# EAGLE design INTERFACE (EAGLE 6.2)
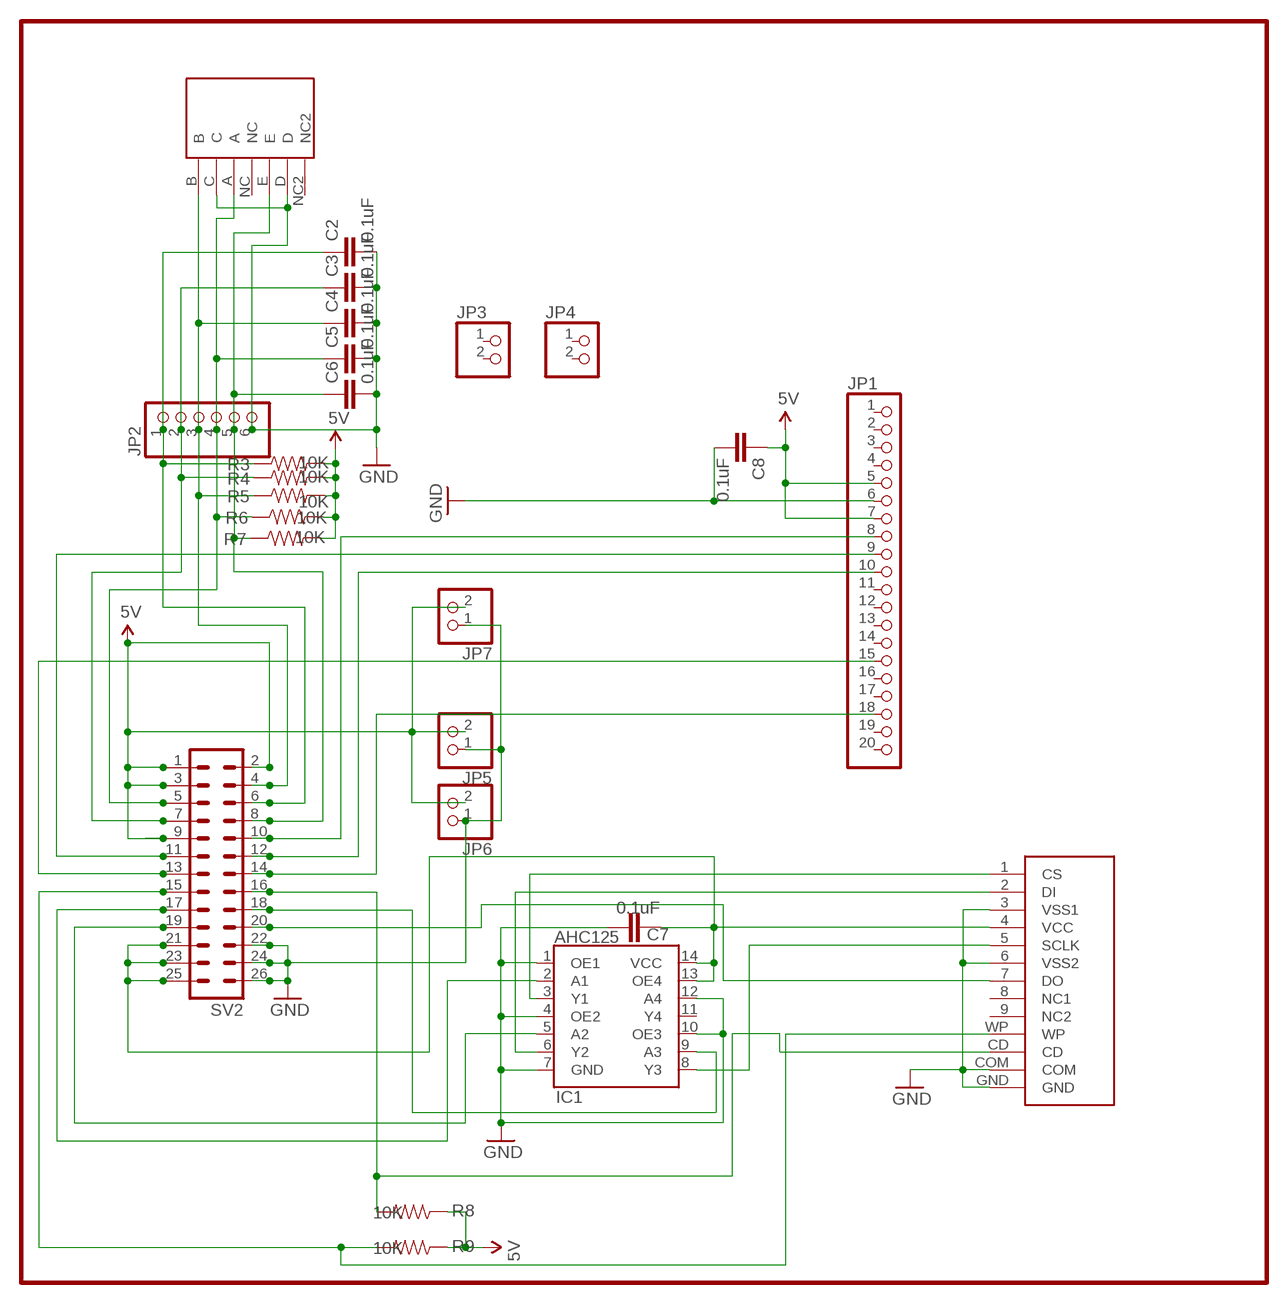
[diagram p0: schematic, sheet 1]

## Parts
C2  0.1uF  CAP0805  [0805]
C3  0.1uF  CAP0805  [0805]
C4  0.1uF  CAP0805  [0805]
C5  0.1uF  CAP0805  [0805]
C6  0.1uF  CAP0805  [0805]
C7  0.1uF  CAP0805  [0805]
C8  0.1uF  CAP0805  [0805]
IC1  AHC125  [DIN14]
JP1  PINHD-1X20  [1X20]
JP2  PINHD-1X6  [1X06]
JP3  PINHD-1X2  [1X02]
JP4  PINHD-1X2  [1X02]
JP5  PINHD-1X2  [1X02]
JP6  PINHD-1X2  [1X02]
JP7  PINHD-1X2  [1X02]
Q2  SDCARD  [SDCARD]
R3  10K  RESISTOR  [0805]
R4  10K  RESISTOR  [0805]
R5  10K  RESISTOR  [0805]
R6  10K  RESISTOR  [0805]
R7  10K  RESISTOR  [0805]
R8  10K  RESISTOR  [0805]
R9  10K  RESISTOR  [0805]
S2  DJFS  [PIN5]
SV2  ML26L  [ML26L]

## Nets
5V: C8.1 JP1.5 JP1.7 JP5.2 JP6.2 JP7.2 R3.2 R4.2 R5.2 R6.2 R7.2 R8.1 R9.1 SV2.1 SV2.2 SV2.3 SV2.9
GND2: C2.2 C3.2 C4.2 C5.2 C6.2 C7.2 C8.2 IC1.1(OE1) IC1.4(OE2) IC1.7(GND) IC1.10(OE3) IC1.12(A4) JP1.6 JP2.6 JP5.1 JP6.1 JP7.1 Q2.3(VSS1) Q2.6(VSS2) Q2.COM Q2.GND S2.C S2.D SV2.22 SV2.24 SV2.26 ; supply symbol labelled GND
N$2: IC1.3(Y1) Q2.1(CS)
N$5: C2.1 JP2.1 R3.1 SV2.6
N$8: IC1.2(A1) SV2.17
N$10: IC1.6(Y2) Q2.2(DI)
N$12: Q2.CD R8.2 SV2.16
N$13: Q2.7(DO) SV2.20
N$18: JP1.15 SV2.13
N$19: JP1.8 SV2.10
N$20: JP1.10 SV2.12
N$21: JP1.9 SV2.11
N$22: JP1.18 SV2.14
N$23: IC1.8(Y3) Q2.5(SCLK)
N$27: C3.1 JP2.2 R4.1 SV2.7
N$28: C4.1 JP2.3 R5.1 S2.B SV2.4
N$29: C5.1 JP2.4 R6.1 S2.A SV2.5
N$30: C6.1 JP2.5 R7.1 S2.E SV2.8
N$31: Q2.WP R9.2 SV2.15
N$33: IC1.5(A2) SV2.19
N$34: C7.1 IC1.13(OE4) IC1.14(VCC) Q2.4(VCC) SV2.21 SV2.23 SV2.25
N$35: IC1.9(A3) SV2.18
Unconnected: IC1.11(Y4) JP1.1 JP1.2 JP1.3 JP1.4 JP1.11 JP1.12 JP1.13 JP1.14 JP1.16 JP1.17 JP1.19 JP1.20 JP3.1 JP3.2 JP4.1 JP4.2 Q2.8(NC1) Q2.9(NC2) S2.NC S2.NC2

## Library data of the parts
C2-C8 = SparkFun2:CAP: Capacitor Standard 0603 ceramic capacitor, and 0.1" leaded capacitor.
IC1 = ahc:AHC125
JP1 = pinhead:PINHD-1X20: PIN HEADER
JP2 = pinhead:PINHD-1X6: PIN HEADER
JP3-JP7 = pinhead:PINHD-1X2: PIN HEADER
Q2 = sd:SDCARD
R3-R9 = SparkFun:RESISTOR: Resistor Basic schematic elements and footprints for 0603, 1206, and PTH 1/10th watt (small) resistors.
S2 = yjfs:DJFS
SV2 = con-ml:ML26L: HARTING; OC_FARNELL: unknown; OC_NEWARK: unknown

## Net classes
0 default: width 0.203 mm, drill 0.508 mm, clearance 0.203 mm
1 5V: width 0.381 mm, drill 0.508 mm, clearance 0.254 mm
2 gnd: width 0.381 mm, drill 0.508 mm, clearance 0.254 mm
3 3.3V: width 0.381 mm, drill 0.508 mm, clearance 0.254 mm

## Board
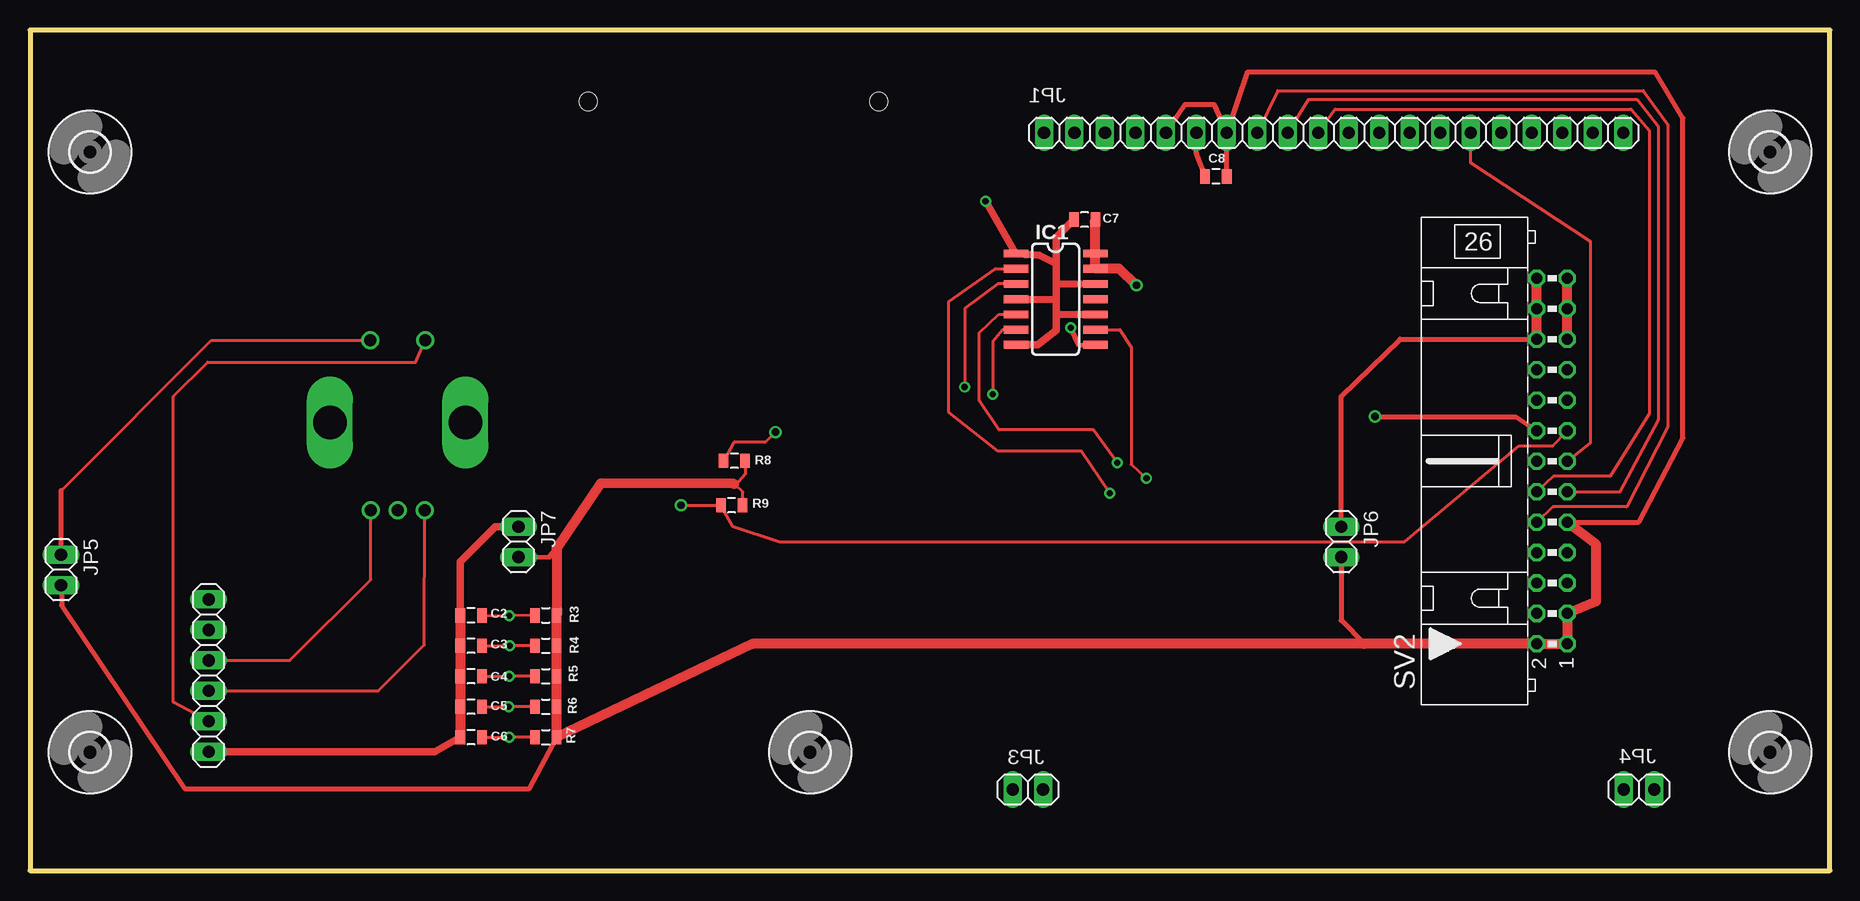
[diagram p1: board, top side]
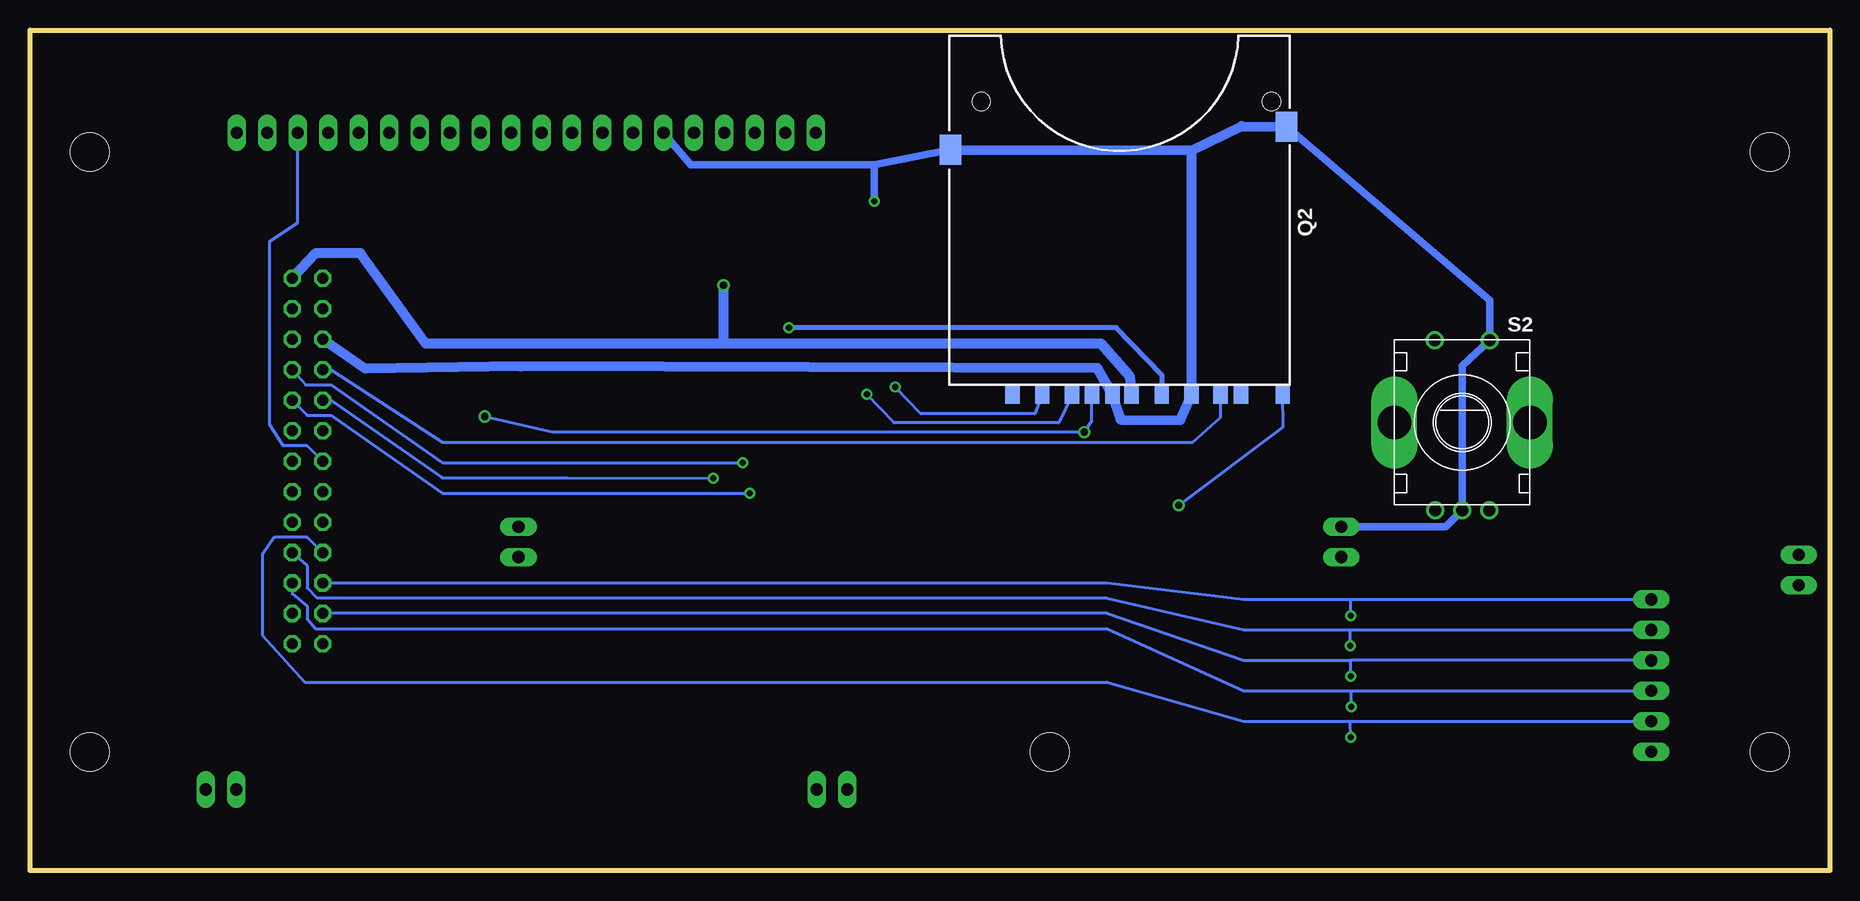
[diagram p2: board, bottom side, seen from below]

Size 149.99 x 70.06 mm. Coordinates in mm from the lower left corner, seen from the top.
Outline: 0,70.06 0,0 149.99,0 149.99,70.06 0,70.06
Copper layers (1*16): Top 0.035mm / dielectric 1.5mm / Bottom 0.035mm
Design rules: minimum track width 10mil, minimum drill 24mil, track to track 8mil, track to pad 8mil, pad to pad 8mil, via to via 8mil, smd to smd 8mil, copper to edge 40mil, drill to drill 8mil, minimum pad ring 10mil, minimum via ring 8mil, stop-mask expansion 4mil, vias tented up to drill 0mil, thermal gap 10mil

### Footprints (pad centres in the part's own frame; a part is rotated, then mirrored left to right if it is on the bottom)
0805 = smd 0.8 x 1.2: 1 -0.9,0; 2 0.9,0
DIN14 = smd 0.66 x 2.032: 1 -3.175,-3.315; 2 -1.905,-3.315; 3 -0.635,-3.315; 4 0.635,-3.315; 5 1.905,-3.315; 6 3.175,-3.315; 7 4.445,-3.315; 8 4.445,3.315; 9 3.175,3.315; 10 1.905,3.315; 11 0.635,3.315; 12 -0.635,3.315; 13 -1.905,3.315; 14 -3.175,3.315
1X20 = drill 1.016 long: 1 -24.13,0; 2 -21.59,0; 3 -19.05,0; 4 -16.51,0; 5 -13.97,0; 6 -11.43,0; 7 -8.89,0; 8 -6.35,0; 9 -3.81,0; 10 -1.27,0; 11 1.27,0; 12 3.81,0; 13 6.35,0; 14 8.89,0; 15 11.43,0; 16 13.97,0; 17 16.51,0; 18 19.05,0; 19 21.59,0; 20 24.13,0
1X06 = drill 1.016 long: 1 -6.35,0; 2 -3.81,0; 3 -1.27,0; 4 1.27,0; 5 3.81,0; 6 6.35,0
1X02 = drill 1.016 long: 1 -1.27,0; 2 1.27,0
SDCARD = smd 1.2 x 1.5: 1 5.74,13.411; 2 3.251,13.411; 3 -0.102,13.411; 4 -1.702,13.411; 5 -4.216,13.411; 6 -6.706,13.411; 7 -9.119,13.411; 8 -10.82,13.411; 9 8.23,13.411; CD 1.6,13.411; WP -14.3,13.411 | smd 1.779 x 2.5: COM -14.624,-8.91; GND 13.386,-6.985 | hole 1.5: -13.37,-11.01; 10.83,-11.01
PIN5 = drill 1: A 3.409,-0.45; B 7.891,-0.45; C 5.65,-0.45; D 7.942,13.716; E 3.358,13.716 | drill 2.8 long: NC 0,6.875; NC2 11.3,6.875
ML26L = drill 0.914 octagon: 1 -15.24,-1.27; 2 -15.24,1.27; 3 -12.7,-1.27; 4 -12.7,1.27; 5 -10.16,-1.27; 6 -10.16,1.27; 7 -7.62,-1.27; 8 -7.62,1.27; 9 -5.08,-1.27; 10 -5.08,1.27; 11 -2.54,-1.27; 12 -2.54,1.27; 13 0,-1.27; 14 0,1.27; 15 2.54,-1.27; 16 2.54,1.27; 17 5.08,-1.27; 18 5.08,1.27; 19 7.62,-1.27; 20 7.62,1.27; 21 10.16,-1.27; 22 10.16,1.27; 23 12.7,-1.27; 24 12.7,1.27; 25 15.24,-1.27; 26 15.24,1.27
3,2 = hole 3.2: 0,0

### Placement (x,y rotation side)
C2  36.75,21.29 180 top
C3  36.75,18.75 180 top
C4  36.75,16.21 180 top
C5  36.75,13.67 180 top
C6  36.75,11.13 180 top
C7  87.88,54.25 180 top
C8  98.83,57.86 180 top
IC1  85.47,48.26 270 top
JP1  108.63,61.49 0 top
JP2  14.88,16.26 270 top
JP3  83.15,6.77 0 top
JP4  134.08,6.77 0 top
JP5  2.59,25.07 270 top
JP6  109.27,27.41 270 top
JP7  40.72,27.41 270 top
Q2  59.89,53.09 180 bottom
R3  42.98,21.29 0 top
R4  42.98,18.75 0 top
R5  42.98,16.21 0 top
R6  42.98,13.67 0 top
R7  42.98,11.13 0 top
R8  58.7,34.16 180 top
R9  58.47,30.45 180 top
S2  36.29,30.48 0 bottom
SV2  126.85,34.14 90 top
U$3  [3,2]  5,59.89 270 top
U$5  [3,2]  5,9.88 270 top
U$11  [3,2]  65.01,9.88 270 top
U$12  [3,2]  145.01,59.89 270 top
U$13  [3,2]  145.01,9.88 270 top

### Tracks (layer width: path | path; a pad name or v marks a point on that pad's centre or on a via)
5V
  Top 0.254: R8.1 59.59,33.02 58.8,32.13 | R9.1 59.41,31.57 58.8,32.13 | 58.8,32.13 58.68,32.25
  Top 0.406: C8.1 JP1.7 | JP1.5 96.27,63.86 98.65,63.86 JP1.7 | SV2.9 134.06,29.06 137.74,36.04 137.74,62.71 135.46,66.52 101.42,66.52 JP1.7 | JP5.2 2.64,22.1 12.9,6.83 41.61,6.83 R7.2 | JP6.2 109.27,20.85 111.18,18.9 | JP7.2 43.28,26.16 43.89,26.87
  Top 0.813: SV2.9 130.51,27.2 130.51,22.45 SV2.3 SV2.1 SV2.2 111.18,18.9 60.22,18.9 R7.2 R6.2 R5.2 R4.2 R3.2 43.89,26.87 47.55,32.28 58.68,32.25
  Bottom 0.254: 99.72,61.52 JP1.7
GND2  (via drill 0.51)
  Top 0.254: 2.59,31.67 15.11,44.2 S2.D
  Top 0.406: C8.2 97.2,59.79 JP1.6 | JP5.1 2.59,31.67 | JP6.1 109.27,39.52 114.17,44.3 SV2.22
  Top 0.61: JP2.6 33.73,9.91 C6.2 | C2.2 35.87,25.76 38.79,28.68 JP7.1 | IC1.7 83.97,43.84 85.52,45.06 85.52,46.33 | 85.52,46.33 85.52,47.6 | 85.52,47.6 85.52,48.87 | 85.52,48.87 85.52,50.6 | 85.52,50.6 84.1,51.31 IC1.1 v79.63,55.78 | IC1.10 85.52,46.33 | IC1.4 85.52,47.6 | IC1.12 85.52,48.87 | C7.2 85.52,52.78 85.52,50.6
  Top 0.813: C2.2 C3.2 C4.2 C5.2 C6.2 | SV2.22 SV2.24 SV2.26
  Bottom 0.254: 59.77,39.34 Q2.3
  Bottom 0.61: Q2.GND 79.63,58.85 | 79.63,58.85 94.92,58.85 JP1.6 | Q2.COM 28.32,47.52 S2.D 30.64,42.06 S2.C 31.99,28.68 JP7.1 | v79.63,55.78 79.63,58.85
  Bottom 0.813: SV2.22 122.05,41.83 109.12,42.04 61.04,41.88 Q2.3 59.11,37.59 54.13,37.54 Q2.6 53.19,60.03 | Q2.GND 53.19,60.03 | 53.19,60.03 49.05,62.05 Q2.COM
N$2  (via drill 0.51)
  Top 0.254: IC1.3 80.65,48.89 77.9,46.86 v77.88,40.31
  Bottom 0.254: Q2.1 66.27,38.07 75.74,38.07 v77.88,40.31
N$5  (via drill 0.51)
  Top 0.254: C2.1 v39.93,21.26 R3.1
  Bottom 0.254: 39.93,22.61 48.84,22.61 60.22,23.98 SV2.6 | 39.93,22.61 JP2.1 | v39.93,21.26 39.93,22.61
N$8  (via drill 0.51)
  Top 0.254: v89.99,31.47 87.6,34.98 80.67,34.98 76.58,38.2 76.58,47.42 80.47,50.16 IC1.2
  Bottom 0.254: SV2.17 126.9,37.95 124.92,37.95 115.65,31.47 v89.99,31.47
N$10  (via drill 0.51)
  Top 0.254: IC1.6 81.08,45.08 80.24,44.07 v80.24,39.7
  Bottom 0.254: Q2.2 64.26,37.31 77.98,37.31 v80.24,39.7
N$12  (via drill 0.61)
  Top 0.254: v62.13,36.55 61.27,35.69 58.65,35.69 R8.2
  Top 0.406: v112.09,37.85 112.19,37.82 123.8,37.82 SV2.16
  Bottom 0.254: Q2.CD 61.49,37.49 v62.13,36.55 106.45,36.55 v112.09,37.85
N$13
  Bottom 0.254: Q2.7 50.77,37.77 53.11,35.69 115.65,35.69 124.92,41.76 SV2.20
N$18
  Top 0.254: SV2.13 130.02,35.66 130.02,52.45 120.06,58.98 JP1.15
N$19
  Top 0.254: SV2.10 126.9,30.33 133.05,30.33 136.47,36.98 136.47,62.2 134.44,65 103.96,65 JP1.8
N$20
  Top 0.254: JP1.10 108.79,63.47 133.43,63.47 134.95,61.7 134.95,38.07 131.67,32.87 126.95,32.87 SV2.12
N$21
  Top 0.254: SV2.11 132.54,31.6 135.71,37.57 135.71,61.95 133.93,64.24 106.5,64.24 JP1.9
N$22
  Bottom 0.254: SV2.14 126.9,35.41 128.88,35.41 130.02,37.16 130.02,52.45 127.68,54 JP1.18
N$23  (via drill 0.51)
  Top 0.406: IC1.8 87.45,43.76 v86.74,45.24
  Bottom 0.406: Q2.5 55.65,41.27 59.46,45.26 v86.74,45.24
N$27  (via drill 0.51)
  Top 0.254: R4.1 v39.98,18.75 C3.1
  Bottom 0.254: SV2.7 126.9,25.4 126.9,23.57 126.04,22.71 60.22,22.71 48.84,20.07 39.95,20.07 | 39.95,20.07 JP2.2 | v39.98,18.75 39.95,20.07
N$28  (via drill 0.51)
  Top 0.254: R5.1 v39.93,16.21 C4.1 | JP2.3 21.67,17.53 28.4,24.26 S2.B
  Bottom 0.254: 39.93,17.53 48.84,17.53 60.22,21.44 SV2.4 | v39.93,16.21 39.93,17.53 | JP2.3 39.93,17.53
N$29  (via drill 0.51)
  Top 0.254: C5.1 v39.88,13.67 R6.1 | JP2.4 29.03,14.99 32.87,18.82 S2.A
  Bottom 0.254: SV2.5 128.14,23.06 126.9,22.05 126.9,20.98 126.19,20.17 60.22,20.17 48.84,14.99 39.88,14.99 | 39.88,14.99 JP2.4 | v39.88,13.67 39.88,14.99
N$30  (via drill 0.51)
  Top 0.254: C6.1 v39.93,11.13 R7.1 | JP2.5 11.94,14.02 11.94,39.52 14.81,42.39 32.13,42.39 S2.E
  Bottom 0.254: SV2.8 126.9,27.79 129.62,27.79 130.63,26.34 130.63,19.63 127.08,15.72 60.22,15.72 48.84,12.45 39.95,12.45 | 39.95,12.45 JP2.5 | v39.93,11.13 39.95,12.45
N$31  (via drill 0.61)
  Top 0.254: SV2.15 126.9,35.41 124.1,35.41 114.55,27.41 62.48,27.41 58.55,28.7 R9.2 v54.25,30.45
  Bottom 0.254: v54.25,30.45 45.57,37.01 Q2.WP
N$33  (via drill 0.51)
  Top 0.254: v90.6,34.01 88.6,36.73 80.75,36.73 79.1,39.17 79.1,44.83 80.75,46.35 IC1.5
  Bottom 0.254: SV2.19 127.03,40.49 124.92,40.49 115.65,34.01 v90.6,34.01
N$34  (via drill 0.61)
  Top 0.813: C7.1 IC1.14 IC1.13 90.75,50.16 v92.2,48.79 | SV2.21 SV2.23 SV2.25
  Bottom 0.813: 92.2,43.92 60.73,43.92 58.32,41.15 Q2.4 | v92.2,48.79 92.2,43.92 | 92.2,43.92 117.02,43.92 122.45,51.46 126.16,51.46 SV2.25
N$35  (via drill 0.51)
  Top 0.254: IC1.9 90.83,45.08 91.77,43.64 91.77,33.86 v93.04,32.72
  Bottom 0.254: SV2.18 124.92,39.22 115.65,32.74 105.18,32.74 v93.04,32.72

### Text on the board
bNames: S2
tTest: VCC | GND | VCC | RS | RST | CS | D3 | D0 | LEFT | + | + | + | RIGHT | UP | DOWN | ENTER | GND